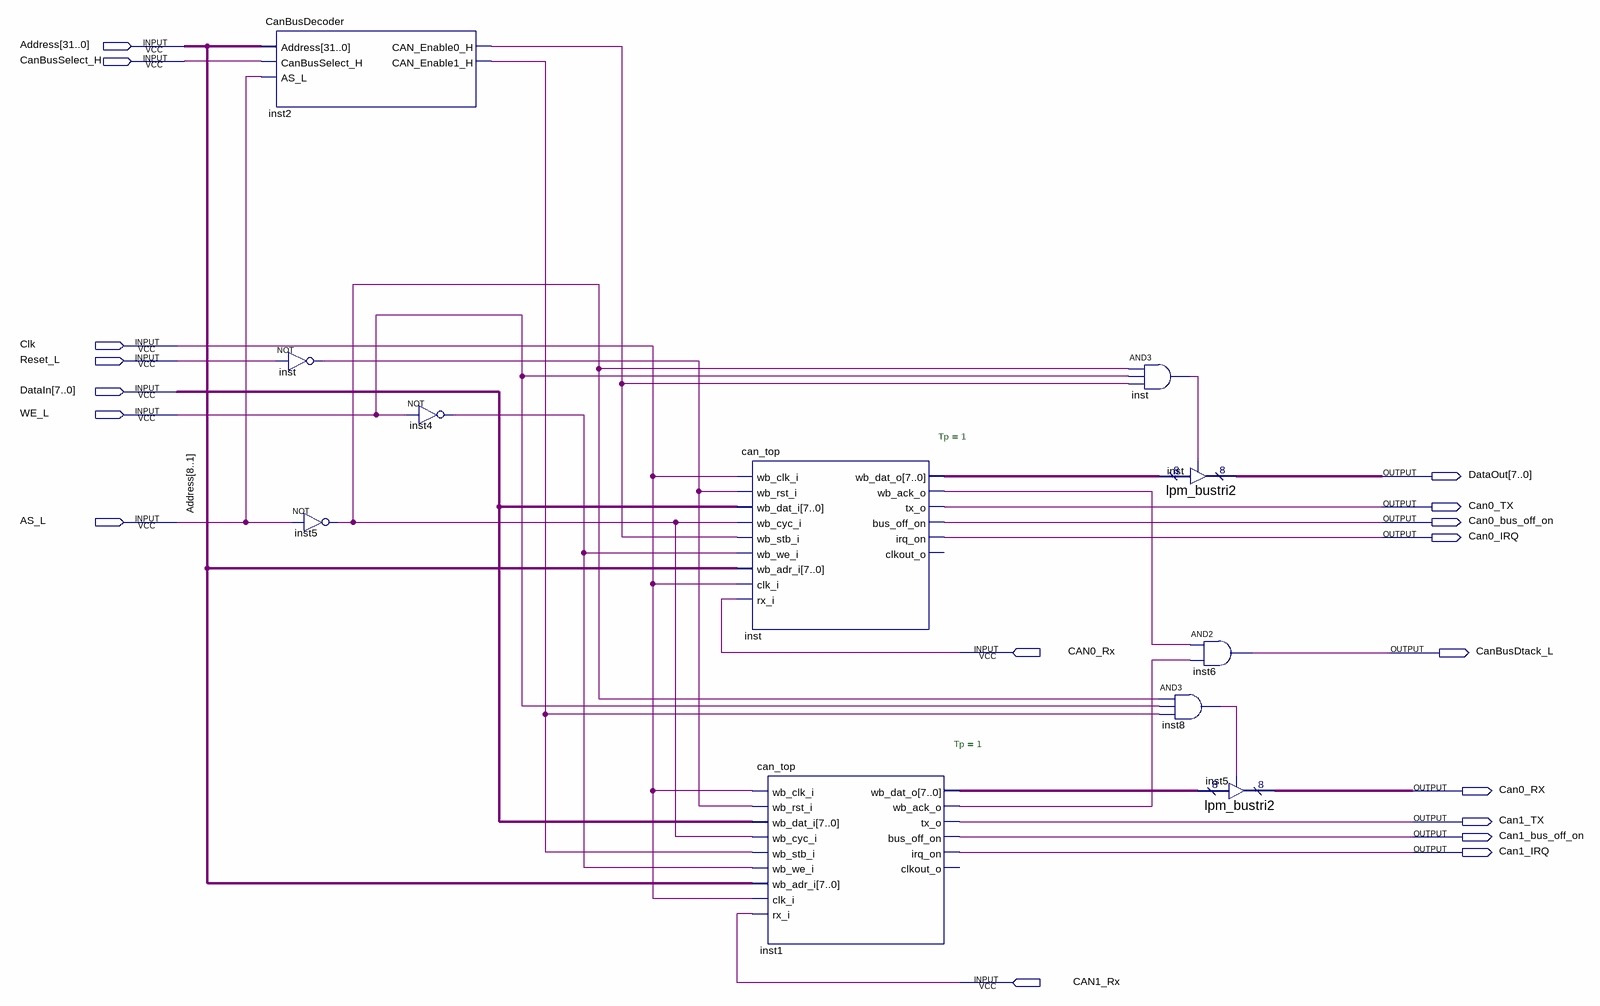
[diagram p0: schematic sheet]
// Quartus schematic CanInterface.bdf as structural Verilog: 11 symbols, 18 pins
module CanInterface (
  input  [31:0] Address,
  input  CanBusSelect_H,
  input  Clk,
  input  Reset_L,
  input  [7:0] DataIn,
  input  WE_L,
  input  AS_L,
  inout  CAN0_Rx,
  input  CAN1_Rx,
  output [7:0] DataOut,
  output Can0_TX,
  output Can0_bus_off_on,
  output Can0_IRQ,
  output CanBusDtack_L,
  output Can1_TX,
  output Can1_bus_off_on,
  output Can1_IRQ
);

  wire inst1_wb_ack_o, inst2_can_enable0_h, inst2_can_enable1_h, inst4_out, inst5_out, inst8_out, inst_out,
       inst_out_2, inst_wb_ack_o;
  wire [7:0] inst1_wb_dat_o, inst5_tridata, inst_wb_dat_o;

  CanBusDecoder inst2 (
    .Address(Address), .CanBusSelect_H(CanBusSelect_H), .AS_L(AS_L), .CAN_Enable0_H(inst2_can_enable0_h),
    .CAN_Enable1_H(inst2_can_enable1_h));
  not inst (inst_out, Reset_L);
  not inst5 (inst5_out, AS_L);
  not inst4 (inst4_out, WE_L);
  can_top #(.Tp(1)) inst_dup2 (
    .wb_clk_i(Clk), .wb_rst_i(inst_out), .wb_dat_i(DataIn), .wb_cyc_i(inst5_out),
    .wb_stb_i(inst2_can_enable0_h), .wb_we_i(inst4_out), .wb_adr_i(Address[8:1]), .clk_i(Clk),
    .rx_i(CAN0_Rx), .wb_dat_o(inst_wb_dat_o), .wb_ack_o(inst_wb_ack_o), .tx_o(Can0_TX),
    .bus_off_on(Can0_bus_off_on), .irq_on(Can0_IRQ));  // open: clkout_o
  can_top #(.Tp(1)) inst1 (
    .wb_clk_i(Clk), .wb_rst_i(inst_out), .wb_dat_i(DataIn), .wb_cyc_i(inst5_out),
    .wb_stb_i(inst2_can_enable1_h), .wb_we_i(inst4_out), .wb_adr_i(Address[8:1]), .clk_i(Clk),
    .rx_i(CAN1_Rx), .wb_dat_o(inst1_wb_dat_o), .wb_ack_o(inst1_wb_ack_o), .tx_o(Can1_TX),
    .bus_off_on(Can1_bus_off_on), .irq_on(Can1_IRQ));  // open: clkout_o
  and inst_dup3 (inst_out_2, inst5_out, WE_L, inst2_can_enable0_h);
  lpm_bustri2 inst_dup4 (.enabledt(inst_out_2), .data(inst_wb_dat_o), .tridata(DataOut));
  and inst6 (CanBusDtack_L, inst_wb_ack_o, inst1_wb_ack_o);
  and inst8 (inst8_out, inst5_out, WE_L, inst2_can_enable1_h);
  lpm_bustri2 inst5_dup2 (.enabledt(inst8_out), .data(inst1_wb_dat_o), .tridata(inst5_tridata));
endmodule
